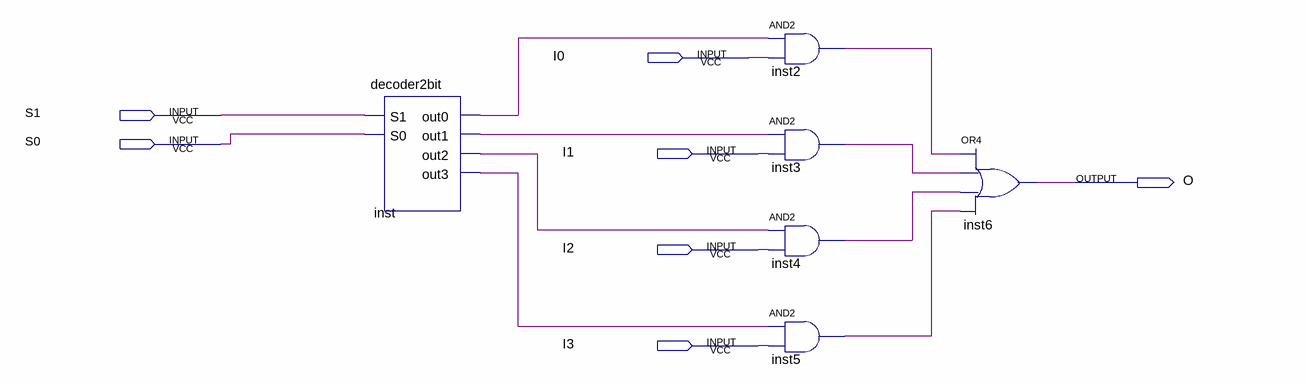
[diagram p0: schematic sheet]
// Quartus schematic Multiplexer4-1.bdf as structural Verilog: 6 symbols, 7 pins
module \Multiplexer4-1  (
  input  I0,
  input  S1,
  input  S0,
  input  I1,
  input  I2,
  input  I3,
  output O
);

  wire inst2_out, inst3_out, inst4_out, inst5_out, inst_out0, inst_out1, inst_out2, inst_out3;

  decoder2bit inst (.S1(S1), .S0(S0), .out0(inst_out0), .out1(inst_out1), .out2(inst_out2), .out3(inst_out3));
  and inst2 (inst2_out, inst_out0, I0);
  and inst3 (inst3_out, inst_out1, I1);
  and inst4 (inst4_out, inst_out2, I2);
  and inst5 (inst5_out, inst_out3, I3);
  or inst6 (O, inst2_out, inst3_out, inst4_out, inst5_out);
endmodule
